# Altium project Clock.PrjPCB
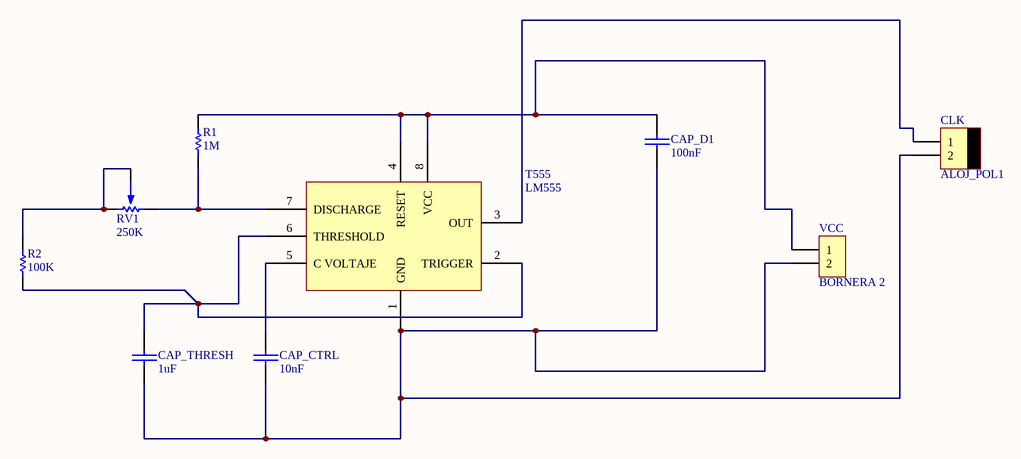
[diagram p0: Schematic.SchDoc]
1 sheet, 9 parts. Net scope: global (net labels, ports and power ports of the same name join across sheets).
Board file: PCB.PcbDoc

## Sheet Schematic.SchDoc
size A

### Parts
CAP_CTRL  10nF  [CAP200]
CAP_D1  100nF  [CAP200]
CAP_THRESH  1uF  [CAP200]
CLK  ALOJ_POL1  [MOLEX2]
R1  1M  [RES400]
R2  100K  [RES400]
RV1  250K  [POTENCIOMETRO]
T555  LM555  [DIP8]
VCC  BORNERA 2  [BORNERA2]

### Nets
NetCAP_CTRL_1: CAP_CTRL.1 T555.5(C_VOLTAJE)
NetCAP_CTRL_2: CAP_CTRL.2 CAP_D1.2 CAP_THRESH.2 CLK.2 T555.1(GND) VCC.2
NetCAP_D1_1: CAP_D1.1 R1.2 T555.4(RESET) T555.8(VCC) VCC.1
NetCAP_THRESH_1: CAP_THRESH.1 R2.1 T555.2(TRIGGER) T555.6(THRESHOLD)
NetCLK_1: CLK.1 T555.3(OUT)
NetR1_1: R1.1 RV1.3 T555.7(DISCHARGE)
NetR2_2: R2.2 RV1.1 RV1.2

### Library data of the parts
CAP_CTRL CAP_D1 CAP_THRESH = CAP
CLK = MOLEX2
R1 R2 = RES
RV1 = POTENCIOMETRO
T555 = LM555: Timer